# Altium schematic sheet 时钟、存储.SchDoc
size A4
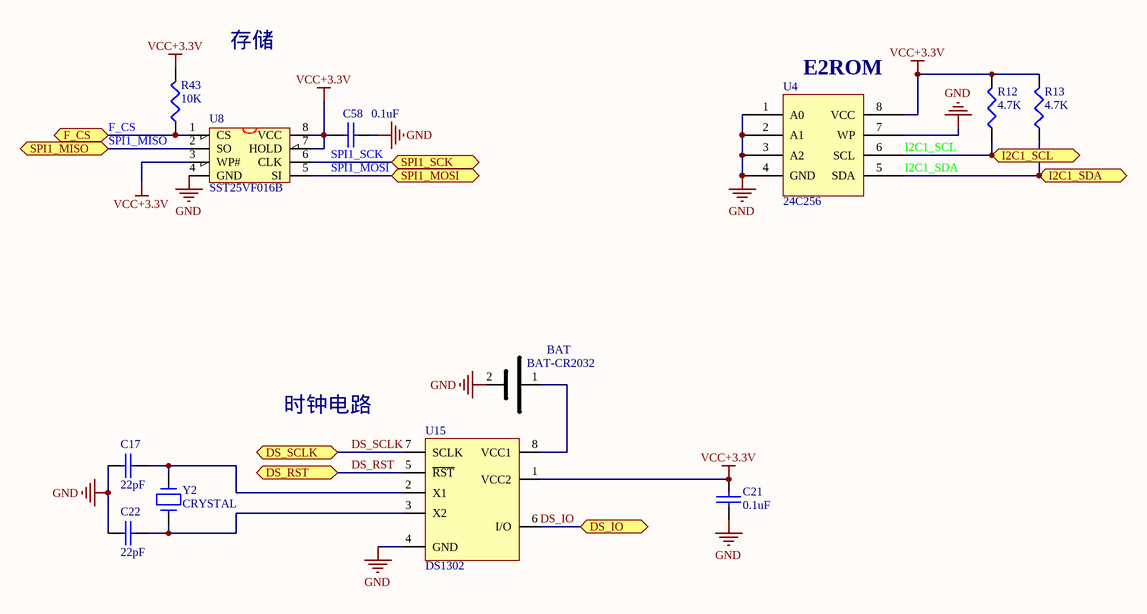
[diagram p0: 时钟、存储.SchDoc]

## Parts
BAT  BAT-CR2032  [CR2032]
C17  22pF  [0603]
C21  0.1uF  [0603]
C22  22pF  [0603]
C58  0.1uF  [0603]
R12  4.7K  [0603]
R13  4.7K  [0603]
R43  10K  [0603]
U4  24C256  [SO-8]
U8  SST25VF016B  [SOIC-8]
U15  DS1302  [SO-8]
Y2  CRYSTAL  [CS206]

## Ports
DS_IO, DS_RST, DS_SCLK, F_CS, I2C1_SCL, I2C1_SDA, SPI1_MISO, SPI1_MOSI, SPI1_SCK

## Nets
GND: BAT.2 C17.1 C21.1 C22.1 C58.1 U4.1(A0) U4.2(A1) U4.3(A2) U4.4(GND) U4.7(WP) U8.4(GND) U15.4(GND)
VCC+3.3V: C21.2 C58.2 R12.2 R13.2 R43.2 U4.8(VCC) U8.3(WP#) U8.7(HOLD) U8.8(VCC) U15.1(VCC2)
DS_IO: U15.6(I/O) ; port DS_IO
DS_RST: U15.5(~{R}~{S}~{T}) ; port DS_RST
DS_SCLK: U15.7(SCLK) ; port DS_SCLK
F_CS: R43.1 U8.1(CS) ; port F_CS
I2C1_SCL: R12.1 U4.6(SCL) ; port I2C1_SCL
I2C1_SDA: R13.1 U4.5(SDA) ; port I2C1_SDA
SPI1_MISO: U8.2(SO) ; port SPI1_MISO
SPI1_MOSI: U8.5(SI) ; port SPI1_MOSI
SPI1_SCK: U8.6(CLK) ; port SPI1_SCK
NetBAT_1: BAT.1 U15.8(VCC1)
NetC17_2: C17.2 U15.2(X1) Y2.2
NetC22_2: C22.2 U15.3(X2) Y2.1

## Notes on the sheet
- 存储
- (near U4) E2ROM
- 时钟电路

## Library data of the parts
BAT = BAT-CR2032: CR2032电池座
C17 C21 C22 = CAP-0603: 0603陶瓷贴片电容
C58 = CAP
R12 R13 R43 = RES-0603: 陶瓷贴片电阻0603封装
U4 = 24C256: E2PROM
U8 = SST25VF016B: SST25VF016  SPI FLASH
U15 = DS1302: DS1302   时钟芯片
Y2 = CRYSTAL: 晶体振荡器2*6